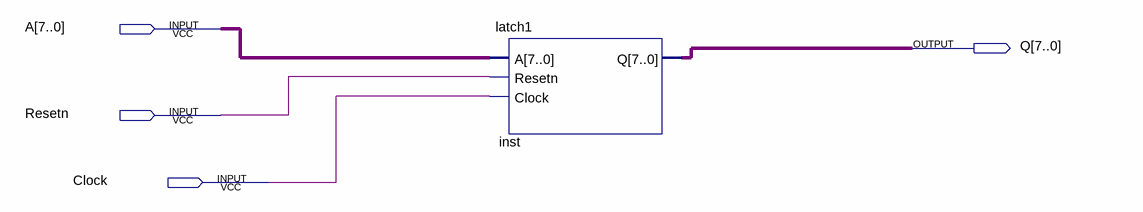
[diagram p0: schematic sheet]
// Quartus schematic latch1diagram.bdf as structural Verilog: 1 symbols, 4 pins
module latch1diagram (
  input  [7:0] A,
  input  Resetn,
  input  Clock,
  output [7:0] Q
);

  latch1 inst (.A(A), .Resetn(Resetn), .Clock(Clock), .Q(Q));
endmodule
